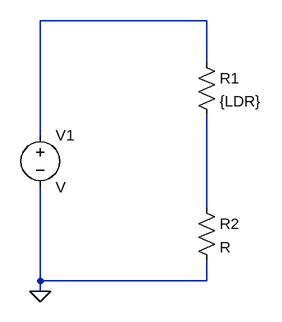
[diagram p0: schematic LDR_Simulation.asc]
LDR_Simulation.asc, the LTspice schematic file:
Version 4
SHEET 1 880 680
WIRE 272 48 16 48
WIRE 272 112 272 48
WIRE 16 224 16 48
WIRE 272 336 272 192
WIRE 16 448 16 304
WIRE 272 448 272 416
WIRE 272 448 16 448
WIRE 16 464 16 448
FLAG 16 464 0
SYMBOL voltage 16 208 R0
SYMATTR InstName V1
SYMBOL res 256 96 R0
SYMATTR InstName R1
SYMATTR Value {LDR}
SYMBOL res 256 320 R0
SYMATTR InstName R2

The netlist it stands for:
* LDR_Simulation.asc
V1 N001 0 V
R1 N001 N002 {LDR}
R2 N002 0 R
.backanno
.end